# EAGLE design butt-on-mk-1.3 (EAGLE 7.5.0)
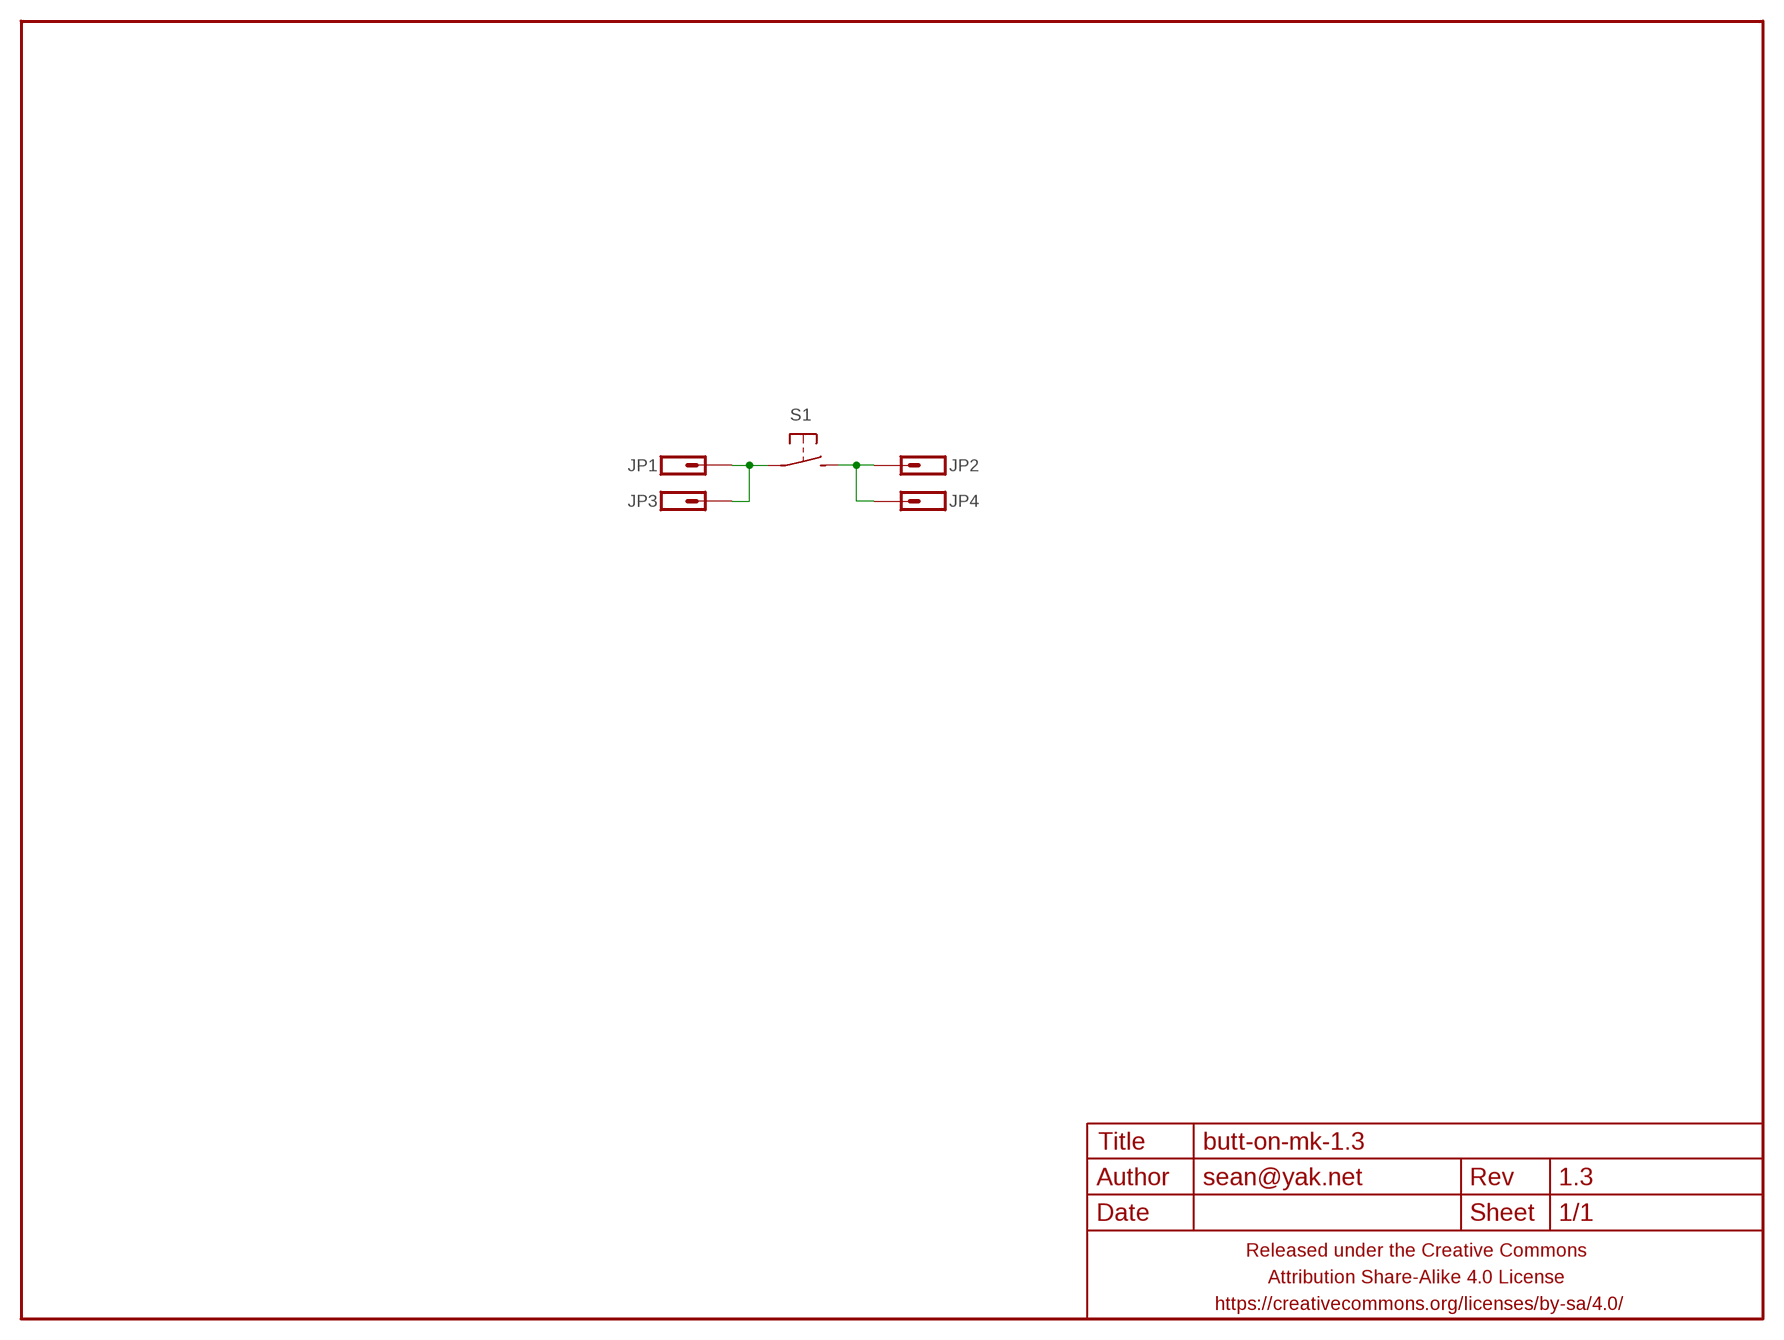
[diagram p0: schematic, sheet 1]

## Parts
FRAME1  FRAME-LETTERNO_PACKAGE  [DUMMY]
JP1  M01PTH-0.9MM-NS  [1X01-0.9MM-NS]
JP2  M01PTH-0.9MM-NS  [1X01-0.9MM-NS]
JP3  M01PTH-0.9MM-NS  [1X01-0.9MM-NS]
JP4  M01PTH-0.9MM-NS  [1X01-0.9MM-NS]
S1  SPST-NO-TACT6MM-PTH-SMALL-PADS  [DTS-6-SMALL-PADS]

## Nets
N$1: JP1.1 JP3.1 S1.1 S1.2
N$2: JP2.1 JP4.1 S1.3 S1.4

## Library data of the parts
FRAME1 = a_parts:FRAME-LETTER: Schematic Frame Standard 8.5x11 US Letter frame; DESIGNER: sean@yak.net; VERSION: 1.3
JP1-JP4 = a_parts:M01: Header 1 Standard 1-pin 0.1" header. Use with straight break away headers (SKU : PRT-00116), right angle break away headers (PRT-00553), swiss pins (PRT-00743), machine pins (PRT-00117), and female headers (PRT-00115).
S1 = a_parts:SPST-NO-TACT

## Board
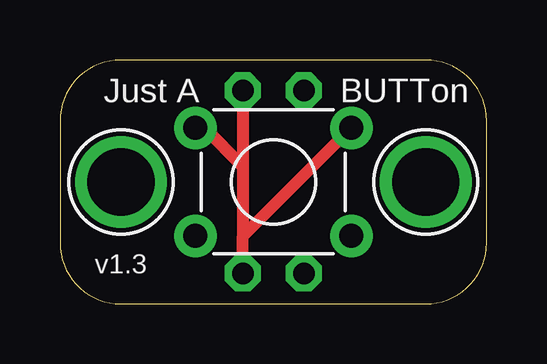
[diagram p1: board, top side]
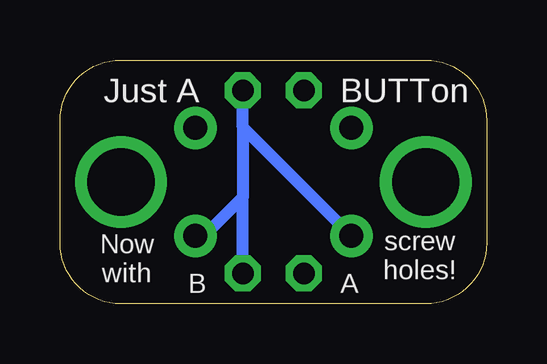
[diagram p2: board, bottom side, seen from below]

Size 17.78 x 10.16 mm. Coordinates in mm from the lower left corner, seen from the top.
Outline: 17.78,2.54 17.78,7.62 arc90 15.24,10.16 2.54,10.16 arc90 0,7.62 0,2.54 arc90 2.54,0 15.24,0 arc90 17.78,2.54
Copper layers (1*16): Top 0.0356mm / dielectric 1.5011mm / Bottom 0.0356mm
Design rules "LaenPCBOrder2": minimum track width 6mil, minimum drill 13mil, track to track 6mil, track to pad 6mil, pad to pad 6mil, via to via 6mil, smd to smd 6mil, copper to edge 15mil, drill to drill 6mil, minimum pad ring 7mil, minimum via ring 7mil, stop-mask expansion 3mil, vias tented up to drill 20mil, thermal gap 10mil

### Footprints (pad centres in the part's own frame; a part is rotated, then mirrored left to right if it is on the bottom)
1X01-0.9MM-NS = drill 0.9 pad 1.5 octagon: 1 0,0
DTS-6-SMALL-PADS = drill 1 pad 1.778: 1 -3.25,2.25; 2 3.25,2.25; 3 -3.25,-2.25; 4 3.25,-2.25

### Placement (x,y rotation side)
FRAME1  0,0 0 top
JP1  7.62,1.27 270 top
JP2  10.16,1.27 270 top
JP3  7.62,8.89 0 top
JP4  10.16,8.89 0 top
S1  8.89,5.08 0 top

### Tracks (layer width: path | path; a pad name or v marks a point on that pad's centre or on a via)
N$1
  Top 0.508: JP1.1 7.62,2.81 | 7.62,2.81 S1.2 | S1.1 6,7.33 7.62,5.71 | 7.62,5.71 7.62,2.81 | JP3.1 7.62,5.71
N$2
  Bottom 0.508: S1.4 11.78,2.83 10.16,4.45 | S1.3 10.16,7.35 | 10.16,7.35 JP4.1 | 10.16,7.35 10.16,4.45 | JP2.1 10.16,4.45
N$3  (via drill 2.8)
  other vias: 2.54,5.08 15.24,5.08

### Text on the board
tPlace: Just A | BUTTon
bPlace: BUTTon | Just A | screw / holes! | A | B | Now / with